# EasyEDA Pro project Esp32.epro

# Schematic BalanceMainBoard
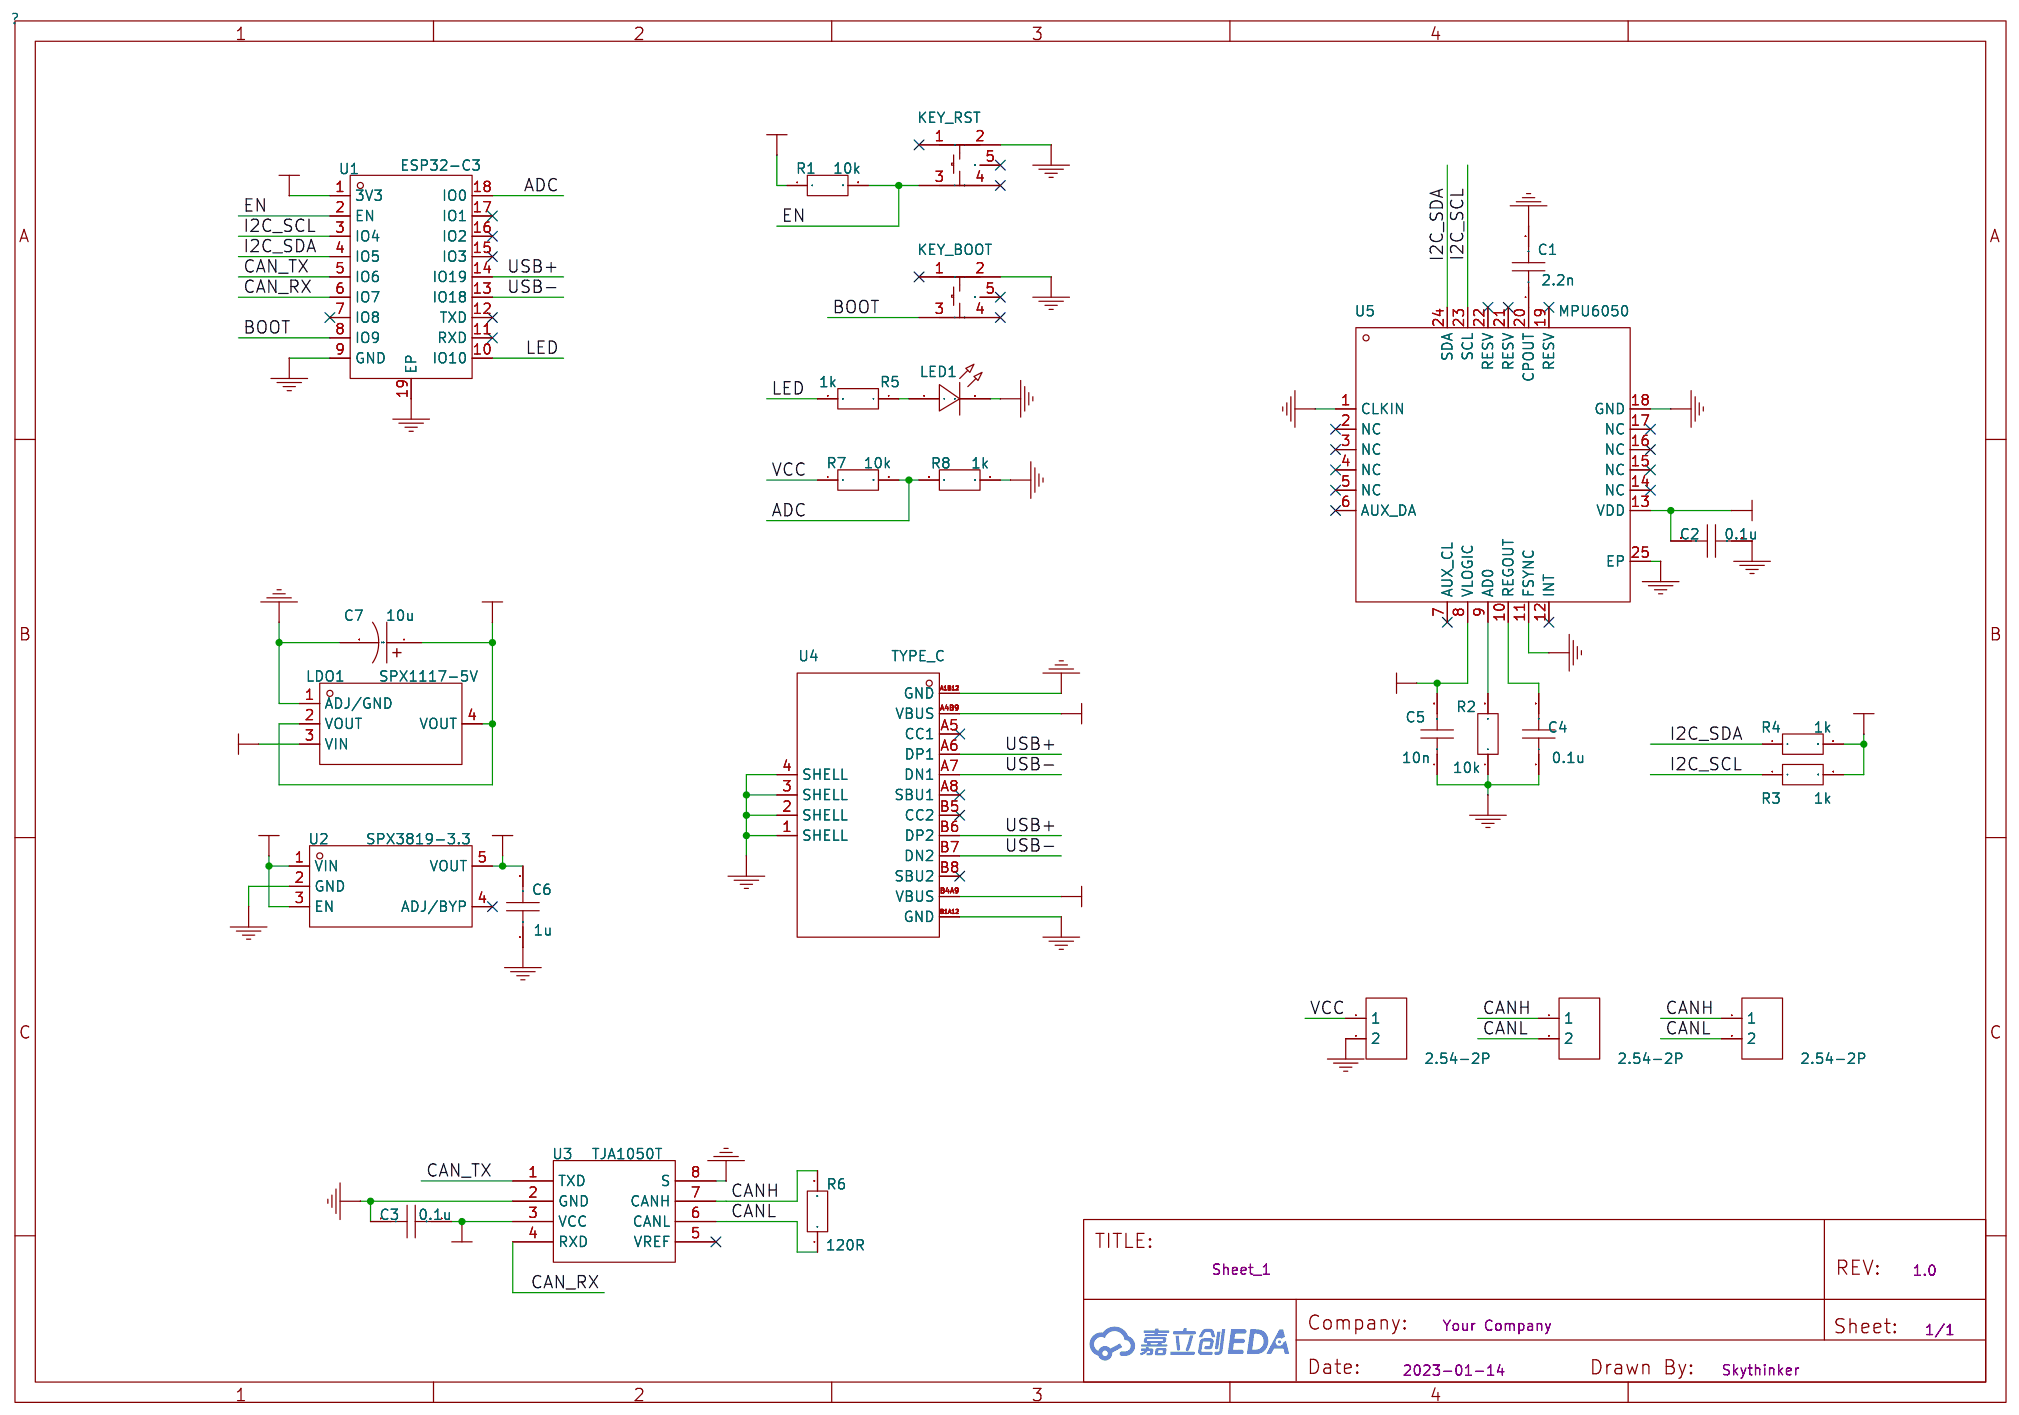
[diagram p0: schematic sheet]

## Parts
C1  2.2n
C2  0.1u
C3  0.1u
C4  0.1u
C5  10n
C6  1u
C7  10u
J1  2.54-2P  (no BOM)
J3  2.54-2P  (no BOM)
J4  2.54-2P  (no BOM)
KEY_BOOT  YTSA007A0152501B
KEY_RST  YTSA007A0152501B
LDO1  SPX1117-5V
LED1  LED-0603_R
R1  10k
R2  10k
R3  1k
R4  1k
R5  1k
R6  120R
R7  10k
R8  1k
U1  ESP32-C3
U2  SPX3819-3.3
U3  TJA1050T
U4  TYPE_C
U5  MPU6050

## Library data of the parts
C1 = 2.2n
C2-C4 = 0.1u
C5 = 10n
C6 = 1u
C7 = 10u
J1 J3 J4 = 2.54-2P: Supplier Part: C124375; Supplier: LCSC
KEY_BOOT KEY_RST = YTSA007A0152501B: Supplier: LCSC; Supplier Part: C967768; Manufacturer: DGBZ; JLCPCB Part Class: Extended Part
LDO1 = SPX1117M3-L/TR: Supplier: LCSC; Manufacturer: MaxLinear; Supplier Part: C67402; JLCPCB Part Class: Extended Part
LED1 = 19-217/R6C-AL1M2VY/3T: Manufacturer: EVERLIGHT(台湾亿光); Supplier Part: C72044; Supplier: LCSC
R1 R2 R7 = 10k
R3-R5 R8 = 1k
R6 = 120R
U1 = ESP32-C3-WROOM-02-N4: Supplier: LCSC; Supplier Part: C9900000362; JLCPCB Part Class: Extended Part; link: https://img.jlc.com//pdf/applyPasteComponent/2021-09-22/691768A/573e676df3ac4789afe05c8f8f79425b/esp32-c3-wroom-02_datasheet_cn.pdf; Manufacturer: null
U2 = SPX3819M5-3.3: Supplier: LCSC; Supplier Part: C9900018941; Manufacturer: null; JLCPCB Part Class: Extended Part
U3 = TJA1050T/CM,118: Supplier: LCSC; Manufacturer: NXP(恩智浦); Supplier Part: C6952; JLCPCB Part Class: Basic Part
U4 = TYPE_16/20: Supplier: LCSC; Supplier Part: C9900017551; Manufacturer: null; JLCPCB Part Class: Extended Part
U5 = MPU6050-YJLTY: Supplier: LCSC; Supplier Part: C2912107; Manufacturer: null; JLCPCB Part Class: Extended Part

## Nets
3V3: C2.1 C5.2 C6.2 R1.1 R3.2 R4.2 U1.1(3V3) U2.5(VOUT) U5.8(VLOGIC) U5.13(VDD)
5V0: C3.2 C7.1 LDO1.2(VOUT) LDO1.4(VOUT) U2.1(VIN) U2.3(EN) U3.3(VCC) U4.A4B9(VBUS) U4.B4A9(VBUS)
GND: C1.2 C2.2 C3.1 C4.1 C5.1 C6.1 C7.2 J1.2 KEY_BOOT.2 KEY_RST.2 LDO1.1(ADJ/GND) LED1.2 R2.1 R8.1 U1.9(GND) U1.19(EP) U2.2(GND) U3.2(GND) U3.8(S) U4.1(SHELL) U4.2(SHELL) U4.3(SHELL) U4.4(SHELL) U4.A1B12(GND) U4.B1A12(GND) U5.1(CLKIN) U5.11(FSYNC) U5.18(GND) U5.25(EP)
VCC: J1.1 LDO1.3(VIN) R7.1
ADC: R7.2 R8.2 U1.18(IO0)
BOOT: KEY_BOOT.3 U1.8(IO9)
CAN_RX: U1.6(IO7) U3.4(RXD)
CAN_TX: U1.5(IO6) U3.1(TXD)
CANH: J3.1 J4.1 R6.2 U3.7(CANH)
CANL: J3.2 J4.2 R6.1 U3.6(CANL)
EN: KEY_RST.3 R1.2 U1.2(EN)
I2C_SCL: R3.1 U1.3(IO4) U5.23(SCL)
I2C_SDA: R4.1 U1.4(IO5) U5.24(SDA)
LED: R5.2 U1.10(IO10)
USB+: U1.14(IO19) U4.A6(DP1) U4.B6(DP2)
USB-: U1.13(IO18) U4.A7(DN1) U4.B7(DN2)
Net-(C1-1): C1.1 U5.20(CPOUT)
Net-(C4-2): C4.2 U5.10(REGOUT)
Net-(LED1-1): LED1.1 R5.1
Net-(R2-2): R2.2 U5.9(AD0)

Not connected (* = marked no-connect by the designer): KEY_BOOT 1* 4* 5*; KEY_RST 1* 4* 5*; U1 7(IO8)* 11(RXD)* 12(TXD)* 15(IO3)* 16(IO2)* 17(IO1)*; U2 4(ADJ/BYP)*; U3 5(VREF)*; U4 A5(CC1)* A8(SBU1)* B5(CC2)* B8(SBU2)*; U5 2(NC)* 3(NC)* 4(NC)* 5(NC)* 6(AUX_DA)* 7(AUX_CL)* 12(INT)* 14(NC)* 15(NC)* 16(NC)* 17(NC)* 19(RESV)* 21(RESV)* 22(RESV)*

# Schematic Schematic1
Create Date: 2023-05-22; Page Name: P1; Project Name: esp32; Schematic Name: Schematic1; Update Date: 2023-08-26; Company: 嘉立创EDA; Page Size: A4; Version: V1.0
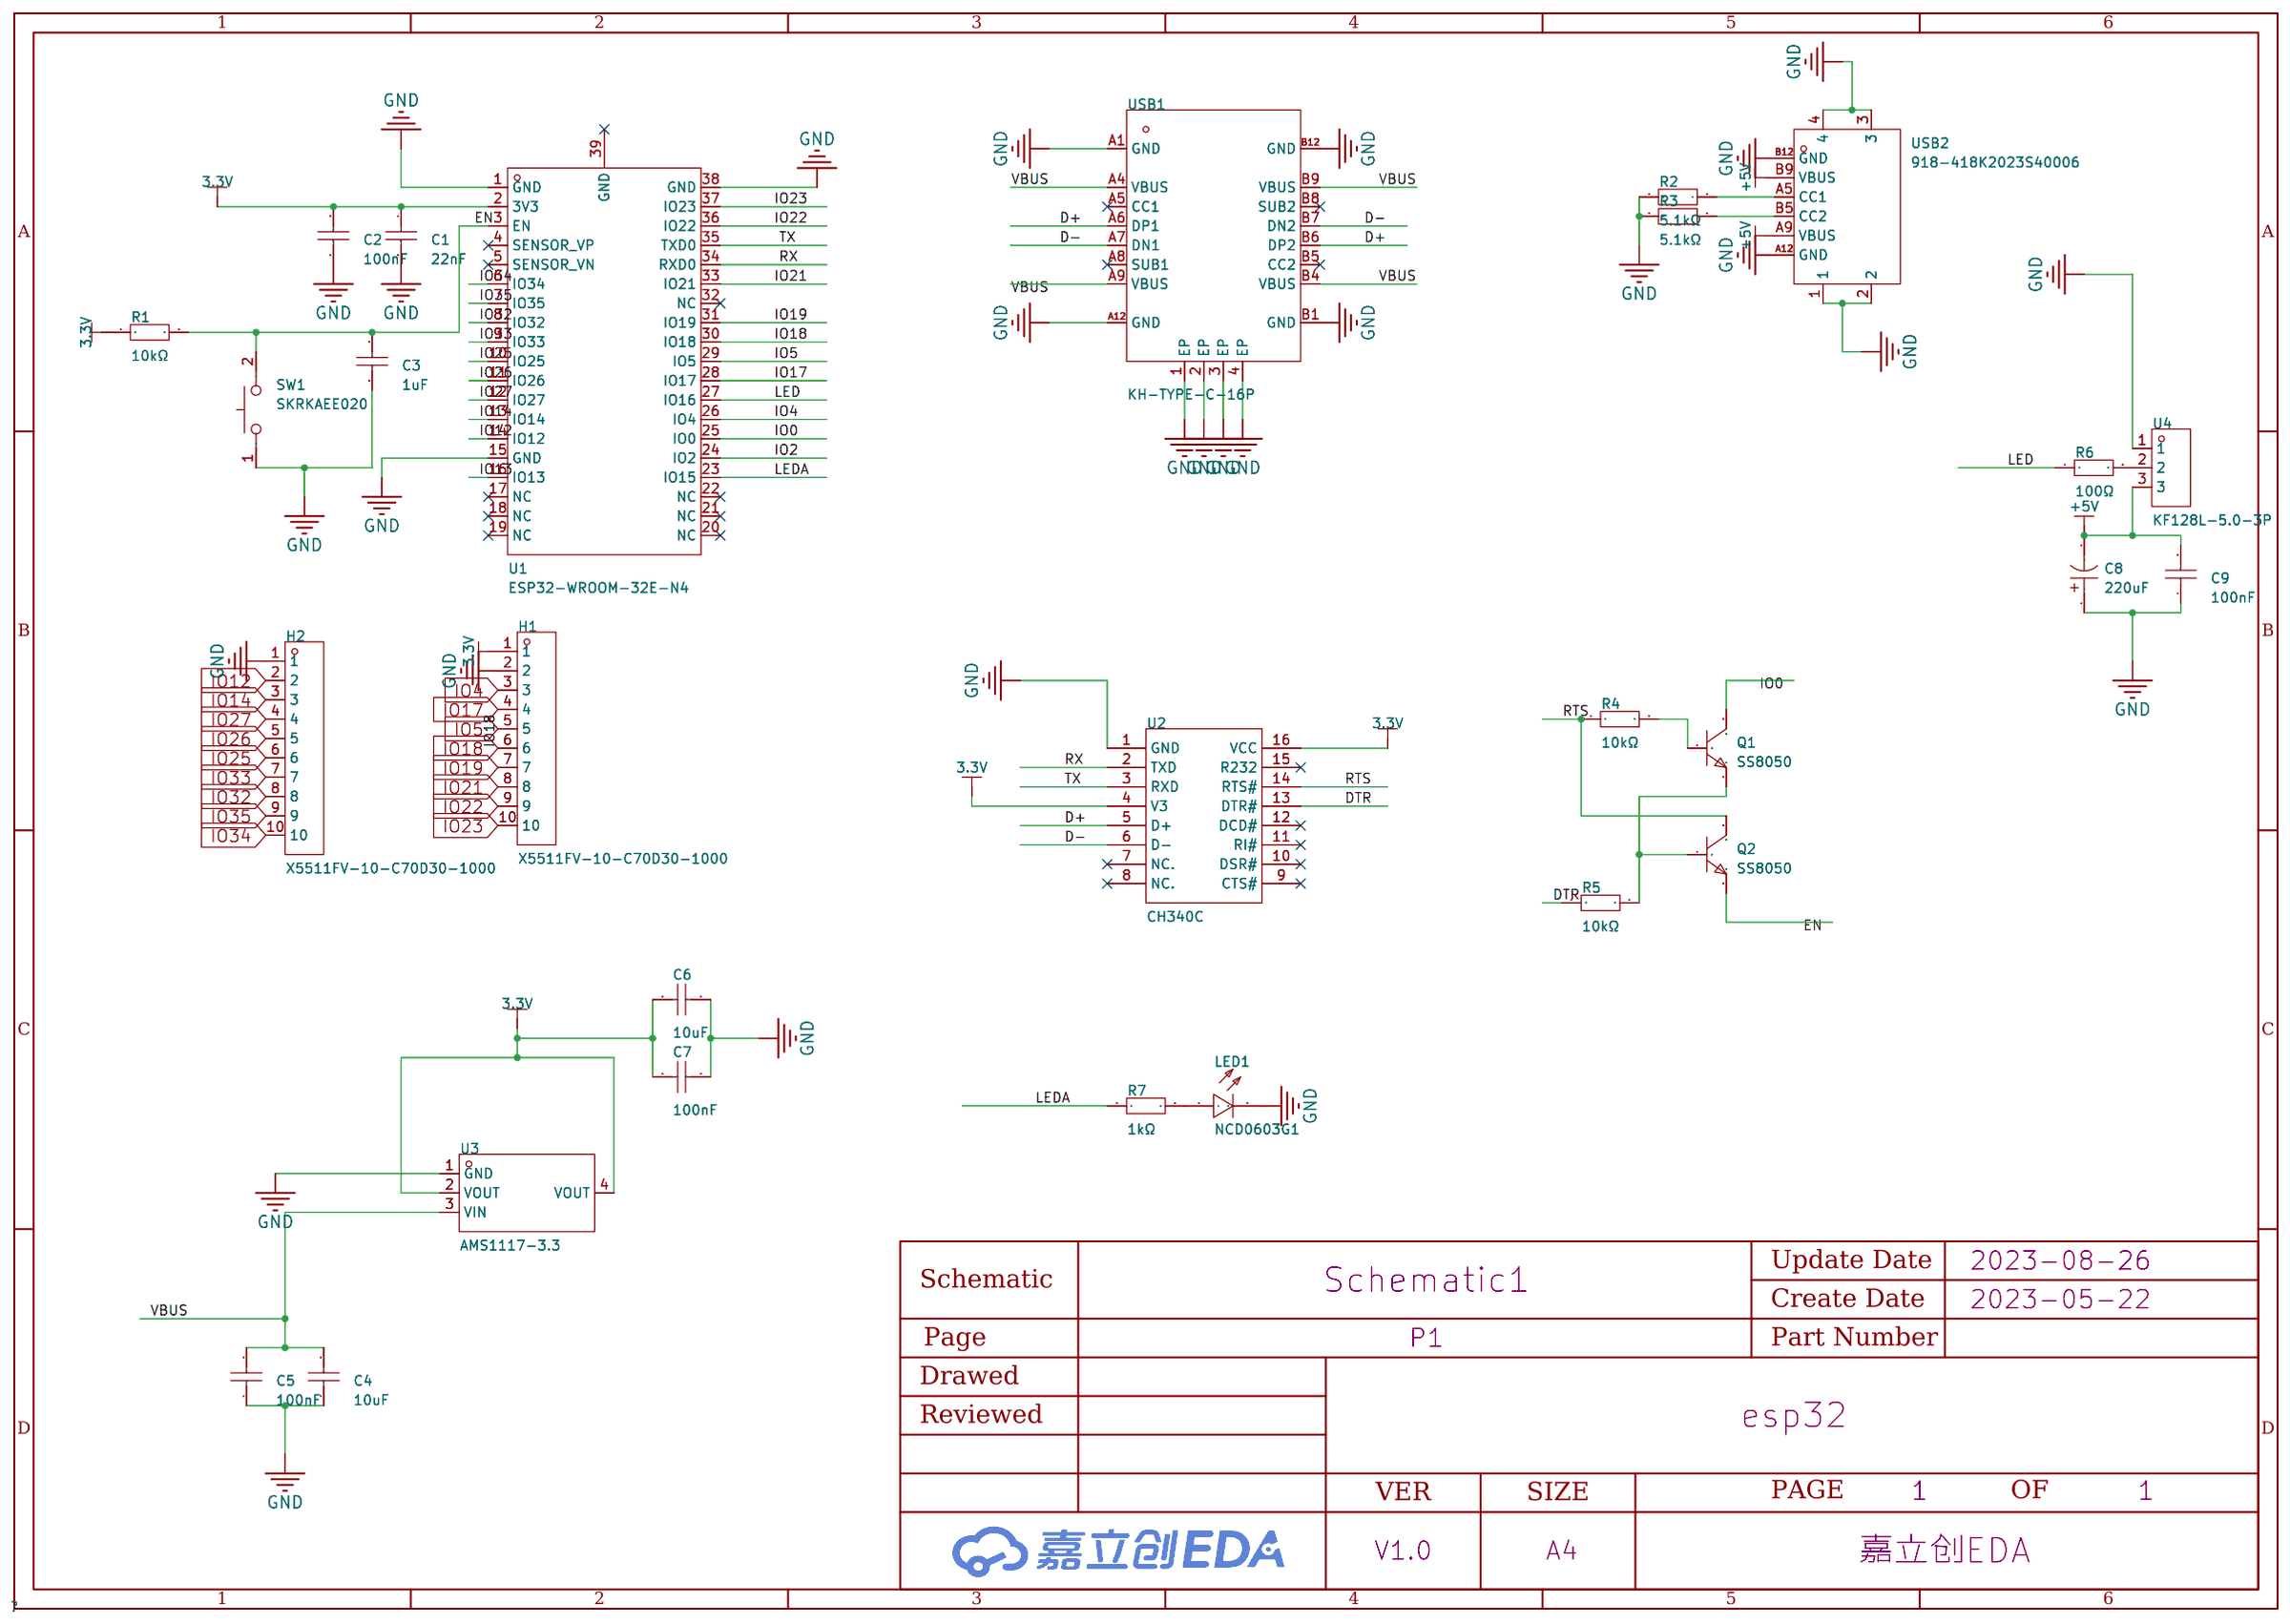
[diagram p1: schematic sheet]

## Parts
C1  22nF  [C0603]
C2  100nF  [C0603]
C3  1uF  [C0603]
C4  10uF  [C1206]
C5  100nF  [C0603]
C6  10uF  [C1206]
C7  100nF  [C0603]
C8  220uF  [CAP-SMD_BD8.0-L8.3-W8.3-LS9.3-FD]
C9  100nF  [C0603]
H1  X5511FV-10-C70D30-1000  [HDR-TH_10P-P2.54-V-F]
H2  X5511FV-10-C70D30-1000  [HDR-TH_10P-P2.54-V-F]
LED1  NCD0603G1  [LED0603-RD]
Q1  SS8050  [SOT-23-3_L2.9-W1.3-P1.90-LS2.4-BR]
Q2  SS8050  [SOT-23-3_L2.9-W1.3-P1.90-LS2.4-BR]
R1  10kΩ  [R0603]
R2  5.1kΩ  [R0603]
R3  5.1kΩ  [R0603]
R4  10kΩ  [R0603]
R5  10kΩ  [R0603]
R6  100Ω  [R0603]
R7  1kΩ  [R0603]
SW1  SKRKAEE020  [SW-SMD_L3.9-W3.0-P4.45]
U1  ESP32-WROOM-32E-N4  [WIFI-SMD_ESP32-WROOM-32E]
U2  CH340C  [SOP-16_L10.0-W3.9-P1.27-LS6.0-BL]
U3  AMS1117-3.3  [SOT-223-3_L6.5-W3.4-P2.30-LS7.0-BR]
U4  KF128L-5.0-3P  [CONN-TH_3P-P5.00_KF128L-5.0-3P]
USB1  KH-TYPE-C-16P  [USB-C-SMD_KH-TYPE-C-16P]
USB2  918-418K2023S40006  [USB-C-SMD_918-418K2023S40006]

## Library data of the parts
C1 = CL10B223KB8NNNC: 容值:22nF;精度:±10%;额定电压:50V;材质(温度系数):X7R;; LCSC Part Name: 22nF ±10% 50V; Supplier Part: C21122; Manufacturer: SAMSUNG(三星); Supplier Footprint: 0603; JLCPCB Part Class: Basic Part; Datasheet: https://atta.szlcsc.com/upload/public/pdf/source/20160103/1457707705232.pdf; Supplier: LCSC; Tolerance: ±10%; Voltage Rated: 50V; Temperature Coefficient: X7R
C2 C5 C7 C9 = 0603B104K500NT: 容值:100nF;精度:±10%;额定电压:50V;材质(温度系数):X7R;; LCSC Part Name: 100nF ±10% 50V; Supplier Part: C30926; Manufacturer: FH(风华); Supplier Footprint: 0603; JLCPCB Part Class: Extended Part; Datasheet: https://atta.szlcsc.com/upload/public/pdf/source/20170923/C30926_1506149436298988724.pdf; Supplier: LCSC; Tolerance: ±10%; Voltage Rated: 50V; Temperature Coefficient: X7R
C3 = CL10A105KB8NNNC: 容值:1uF;精度:±10%;额定电压:50V;材质(温度系数):X5R;; LCSC Part Name: 1uF ±10% 50V; Supplier Part: C15849; Manufacturer: SAMSUNG(三星); Supplier Footprint: 0603; JLCPCB Part Class: Basic Part; Datasheet: https://atta.szlcsc.com/upload/public/pdf/source/20160103/1457707679084.pdf; Supplier: LCSC; Tolerance: ±10%; Voltage Rated: 50V; Temperature Coefficient: X5R
C4 C6 = CL31A106KBHNNNE: 容值:10uF;精度:±10%;额定电压:50V;材质(温度系数):X5R;; LCSC Part Name: 10uF ±10% 50V; Supplier Part: C13585; Manufacturer: SAMSUNG(三星); Supplier Footprint: 1206; JLCPCB Part Class: Basic Part; Datasheet: https://atta.szlcsc.com/upload/public/pdf/source/20160103/1457707668742.pdf; Supplier: LCSC; Tolerance: ±10%; Voltage Rated: 50V; Temperature Coefficient: X5R
C8 = RVT220UF35V67RV0024: 容值:220uF;额定电压:35V;纹波电流:-;等效串联电阻:-;; LCSC Part Name: 220uF 35V; Supplier Part: C2836441; Manufacturer: KNSCHA(科尼盛); Supplier Footprint: SMD,D8xL10.2mm; JLCPCB Part Class: Extended Part; Datasheet: https://atta.szlcsc.com/upload/public/pdf/source/20210528/C2836441_17B1F737CDEB8BC64E6C288AF923F1CC.pdf; Supplier: LCSC; Rated Voltage: 35V; Lifetime @ Temp: 2000hrs@105℃
H1 H2 = X5511FV-10-C70D30-1000: 排数:单排;总孔位数:10;间距:2.54mm;插孔结构:1x10P;行距:-;安装类型:直插;圆孔/方孔:圆孔;额定电流:3A;额定电压:-;插孔方向:顶部;塑高:7mm;触头材质:黄铜;触头镀层:金;工作温度范围:-40℃~+105℃;焊接温度(最大值):260℃;; LCSC Part Name: 2.54mm 1x10P; Supplier Part: C2684744; Manufacturer: XKB Connectivity(中国星坤); Supplier Footprint: 直插,P=2.54mm; JLCPCB Part Class: Extended Part; Datasheet: https://atta.szlcsc.com/upload/public/pdf/source/20210118/C2684739_C189B04B0AEE96BAD6B95F9E817AD865.pdf; Supplier: LCSC; Number of Rows: 单排; Number of Holes: 10; Pitch: 2.54mm; Holes Structure: 1x10P; Mounting Type: 直插; Circular Hole / Square Hole: 圆孔; Current Rating (Max): 3A; Holes Direction: 顶部; Insulation Height: 7mm; Contact Material: 黄铜; Contact Plating: 金; Operating Temperature Range: -40℃~+105℃; Welding Temperature (Max): 260℃
LED1 = NCD0603G1: 发光颜色:翠绿;; LCSC Part Name: 翠绿; Supplier Part: C84267; Manufacturer: 国星光电; Supplier Footprint: 0603; JLCPCB Part Class: Extended Part; Datasheet: https://atta.szlcsc.com/upload/public/pdf/source/20200820/C84267_04BA7703640BAC111D09F5EFB971FBF3.pdf; Supplier: LCSC; Emitted Color: 翠绿
Q1 Q2 = SS8050_C2150: 晶体管类型:NPN;集射极击穿电压(Vceo):25V;集电极电流(Ic):1.5A;功率(Pd):300mW;直流电流增益(hFE@Ic,Vce):200@100mA,1V;; LCSC Part Name: NPN 25V 1.5A Y1 200-350; Supplier Part: C2150; Manufacturer: CJ(江苏长电/长晶); Supplier Footprint: SOT-23; JLCPCB Part Class: Basic Part; Datasheet: https://atta.szlcsc.com/upload/public/pdf/source/20230322/AEE86F4B043774EFF80CAEA14A37D9E9.pdf; Supplier: LCSC; Transistor Type: NPN; Collector-Emitter Breakdown Voltage (Vceo): 25V; Collector Current (Ic): 1.5A; Power Dissipation (Pd): 300mW; Collector Cut-Off Current (Icbo): 100nA; Collector-Emitter Saturation Voltage (VCE(sat)@Ic,Ib): 500mV@800mA,80mA; DC Current Gain (hFE@Ic,Vce): 200@100mA,1V; Transition Frequency (fT): 100MHz; Operating Temperature: +150℃@(Tj)
R1 R4 R5 = 0603WAF1002T5E: 电阻类型:厚膜电阻;阻值:10kΩ;精度:±1%;功率:100mW;; LCSC Part Name: 厚膜电阻 10kΩ ±1% 100mW; Supplier Part: C25804; Manufacturer: UNI-ROYAL(厚声); Supplier Footprint: 0603; JLCPCB Part Class: Basic Part; Datasheet: https://atta.szlcsc.com/upload/public/pdf/source/20200306/C422600_1E6D84923E4A46A82E41ADD87F860B5C.pdf; Supplier: LCSC; Type: 厚膜电阻; Tolerance: ±1%; Power(Watts): 100mW; Temperature Coefficient: ±100ppm/℃; Overload Voltage (Max): 75V; Operating Temperature Range: -55℃~+155℃
R2 R3 = 0603WAF5101T5E: 电阻类型:厚膜电阻;阻值:5.1kΩ;精度:±1%;功率:100mW;; LCSC Part Name: 5.1kΩ ±1% 100mW; Supplier Part: C23186; Manufacturer: UNI-ROYAL(厚声); Supplier Footprint: 0603; JLCPCB Part Class: Basic Part; Datasheet: https://atta.szlcsc.com/upload/public/pdf/source/20200306/C422600_1E6D84923E4A46A82E41ADD87F860B5C.pdf; Supplier: LCSC; Type: 厚膜电阻; Tolerance: ±1%; Power(Watts): 100mW; Temperature Coefficient: ±100ppm/℃; Overload Voltage (Max): 75V; Operating Temperature Range: -55℃~+155℃
R6 = 0603WAF1000T5E: 电阻类型:厚膜电阻;阻值:100Ω;精度:±1%;功率:100mW;; LCSC Part Name: 100Ω ±1% 100mW; Supplier Part: C22775; Manufacturer: UNI-ROYAL(厚声); Supplier Footprint: 0603; JLCPCB Part Class: Basic Part; Datasheet: https://atta.szlcsc.com/upload/public/pdf/source/20200306/C422600_1E6D84923E4A46A82E41ADD87F860B5C.pdf; Supplier: LCSC; Type: 厚膜电阻; Tolerance: ±1%; Power(Watts): 100mW; Temperature Coefficient: ±200ppm/℃; Overload Voltage (Max): 75V; Operating Temperature Range: -55℃~+155℃
R7 = 0603WAF1001T5E: 电阻类型:厚膜电阻;阻值:1kΩ;精度:±1%;功率:100mW;; LCSC Part Name: 1kΩ ±1% 100mW; Supplier Part: C21190; Manufacturer: UNI-ROYAL(厚声); Supplier Footprint: 0603; JLCPCB Part Class: Basic Part; Datasheet: https://atta.szlcsc.com/upload/public/pdf/source/20200306/C422600_1E6D84923E4A46A82E41ADD87F860B5C.pdf; Supplier: LCSC; Type: 厚膜电阻; Tolerance: ±1%; Power(Watts): 100mW; Temperature Coefficient: ±100ppm/℃; Overload Voltage (Max): 75V; Operating Temperature Range: -55℃~+155℃
SW1 = SKRKAEE020: 触点电流:50mA;额定电压(DC):12V;电路结构:单刀单掷;安装方式:立贴;带灯:-;机械寿命:-;; LCSC Part Name: 3.9*2.9*2mm 立贴 轻触开关; Supplier Part: C115357; Manufacturer: ALPSALPINE(阿尔卑斯阿尔派); Supplier Footprint: SMD; JLCPCB Part Class: Extended Part; Datasheet: https://atta.szlcsc.com/upload/public/pdf/source/20170620/1497944814772.pdf; Supplier: LCSC; Contact Current: 50mA; Voltage Rating (DC): 12V; Circuit: 单刀单掷; Mounting Style: 立贴; Actuator Style: 圆形按钮; Switch Length: 3.9mm; Switch Width: 2.9mm; Switch Height: 2mm
U1 = ESP32-WROOM-32E-N4_C701341: ESP32-WROOM-32E 集成 ESP32-D0WD-V3 芯片，具有?高的稳定性和安全性能。; LCSC Part Name: 通用型Wi-Fi+BT+BLE的MCU模组 PCB板载天线模组; Supplier Part: C701341; Manufacturer: ESPRESSIF(乐鑫); Supplier Footprint: SMD,18x25.5mm; JLCPCB Part Class: Extended Part; Datasheet: https://atta.szlcsc.com/upload/public/pdf/source/20220601/0020821B65DE5740BBACA5FACC5CF3B6.pdf; Supplier: LCSC
U2 = CH340C: 应用功能:Transceiver;接口协议:USB 2.0;数据速率:2Mbps;供电电压:3.3V；5V;; Supplier Part: C84681; Manufacturer: WCH(南京沁恒); Supplier Footprint: SOP-16; JLCPCB Part Class: Extended Part; Datasheet: https://atta.szlcsc.com/upload/public/pdf/source/20200819/C84681_ADBED554CE321879DBD6B1D06488689C.pdf; Supplier: LCSC; Applications Function: Transceiver; Protocol: USB 2.0; Data Rate: 2Mbps; Supply Voltage: 3.3V；5V
U3 = AMS1117-3.3_C6186: 输出类型:固定;输出极性:正;最大输入电压:-;输出电压:3.3V;输出电流:1A;电源纹波抑制比(PSRR):72dB@(120Hz);; LCSC Part Name: 输出3.3V 1A; Supplier Part: C6186; Manufacturer: AMS; Supplier Footprint: SOT-223; JLCPCB Part Class: Basic Part; Datasheet: https://atta.szlcsc.com/upload/public/pdf/source/20180727/C6186_7A095716F0823C02F1997A905E26C086.pdf; Supplier: LCSC; Output Type: 固定; Output Polarity: 正; Number of Outputs: 1; Output Voltage: 3.3V; Dropout Voltage: 1.3V@(800mA); Output Current: 1A; Power Supply Rejection Ratio (PSRR): 72dB@(120Hz)
U4 = KF128L-5.0-3P: LCSC Part Name: 间距P=5.0mm 3Pin位 直插 直针 可拼接 铜 环保 可拼接 铜 环保; Supplier Part: C474939; Manufacturer: KEFA(科发); Supplier Footprint: P=5mm; JLCPCB Part Class: Extended Part; Datasheet: https://atta.szlcsc.com/upload/public/pdf/source/20230317/752C0AC053DC32F5BE41F95D5E9BCBBC.pdf; Supplier: LCSC
USB1 = KH-TYPE-C-16P: 连接器类型:Type-C;标准:-;公母:母座;触点数量:16;端口数量:1;安装方式:卧贴;额定电流 - 电源:3A;工作温度范围:-40℃~+85℃;; LCSC Part Name: Type-C 母座 卧贴; Supplier Part: C709357; Manufacturer: kinghelm(金航标); Supplier Footprint: SMD; JLCPCB Part Class: Extended Part; Datasheet: https://atta.szlcsc.com/upload/public/pdf/source/20200911/C709357_AA8DCEB38BB20E3035A7ED7AE7667837.pdf; Supplier: LCSC; Connector Type: Type-C; Gender: 母座; Number of Contacts: 16; Number of Ports: 1; Mounting Style: 卧贴; Current Rating - Power (Max): 3A; Operating Temperature Range: -40℃~+85℃
USB2 = 918-418K2023S40006: 连接器类型:Type-C;标准:USB 3.1;公母:母座;触点数量:6;端口数量:1;安装方式:卧贴;额定电流 - 电源:-;工作温度范围:-40℃~+85℃;; LCSC Part Name: Type-C 母座 卧贴 无弹单排LCP黑胶; Supplier Part: C399925; Manufacturer: 精拓金; Supplier Footprint: SMD; JLCPCB Part Class: Extended Part; Datasheet: https://atta.szlcsc.com/upload/public/pdf/source/20190620/C399925_D8B78B8101E8027AE7B71A8976357F30.pdf; Supplier: LCSC; Connector Type: Type-C; Standard: USB 3.1; Gender: 母座; Number of Contacts: 6; Number of Ports: 1; Mounting Style: 卧贴; Operating Temperature Range: -40℃~+85℃

## Nets
3.3V: C1.1 C2.2 C6.2 C7.2 H1.1 R1.1 U1.2(3V3) U2.4(V3) U2.16(VCC) U3.2(VOUT) U3.4(VOUT)
+5V: C8.2 C9.2 U4.3 USB2.A9(VBUS) USB2.B9(VBUS)
GND: C1.2 C2.1 C3.1 C4.1 C5.1 C6.1 C7.1 C8.1 C9.1 H1.2 H2.1 LED1.1(K) R2.2 R3.2 SW1.1 U1.1(GND) U1.15(GND) U1.38(GND) U2.1(GND) U3.1(GND) U4.1 USB1.1(EP) USB1.2(EP) USB1.3(EP) USB1.4(EP) USB1.A1(GND) USB1.A12(GND) USB1.B1(GND) USB1.B12(GND) USB2.1 USB2.2 USB2.3 USB2.4 USB2.A12(GND) USB2.B12(GND)
VBUS: C4.2 C5.2 U3.3(VIN) USB1.A4(VBUS) USB1.A9(VBUS) USB1.B4(VBUS) USB1.B9(VBUS)
D+: U2.5(D+) USB1.A6(DP1) USB1.B6(DP2)
D-: U2.6(D-) USB1.A7(DN1) USB1.B7(DN2)
DTR: R5.1 U2.13(DTR#)
EN: C3.2 Q2.2(E) R1.2 SW1.2 U1.3(EN)
IO0: Q1.3(C) U1.25(IO0)
IO2: U1.24(IO2)
IO4: H1.3 U1.26(IO4)
IO5: H1.5 U1.29(IO5)
IO12: H2.2 U1.14(IO12)
IO13: U1.16(IO13)
IO14: H2.3 U1.13(IO14)
IO17: H1.4 U1.28(IO17)
IO18: H1.6 U1.30(IO18)
IO19: H1.7 U1.31(IO19)
IO21: H1.8 U1.33(IO21)
IO22: H1.9 U1.36(IO22)
IO23: H1.10 U1.37(IO23)
IO25: H2.6 U1.10(IO25)
IO26: H2.5 U1.11(IO26)
IO27: H2.4 U1.12(IO27)
IO32: H2.8 U1.8(IO32)
IO33: H2.7 U1.9(IO33)
IO34: H2.10 U1.6(IO34)
IO35: H2.9 U1.7(IO35)
LED: R6.1 U1.27(IO16)
LEDA: R7.1 U1.23(IO15)
RTS: Q2.3(C) R4.1 U2.14(RTS#)
RX: U1.34(RXD0) U2.2(TXD)
TX: U1.35(TXD0) U2.3(RXD)
$1N2213: R2.1 USB2.A5(CC1)
$1N2350: R3.1 USB2.B5(CC2)
$1N2939: Q1.1(B) R4.2
$1N4330: R6.2 U4.2
$1N4919: LED1.2(A) R7.2
$1N5572: Q1.2(E) Q2.1(B) R5.2

Not connected (* = marked no-connect by the designer): U1 4(SENSOR_VP)* 5(SENSOR_VN)* 17(NC)* 18(NC)* 19(NC)* 20(NC)* 21(NC)* 22(NC)* 32(NC)* 39(GND)*; U2 7(NC.)* 8(NC.)* 9(CTS#)* 10(DSR#)* 11(RI#)* 12(DCD#)* 15(R232)*; USB1 A5(CC1)* A8(SUB1)* B5(CC2)* B8(SUB2)*

# Board PCB4
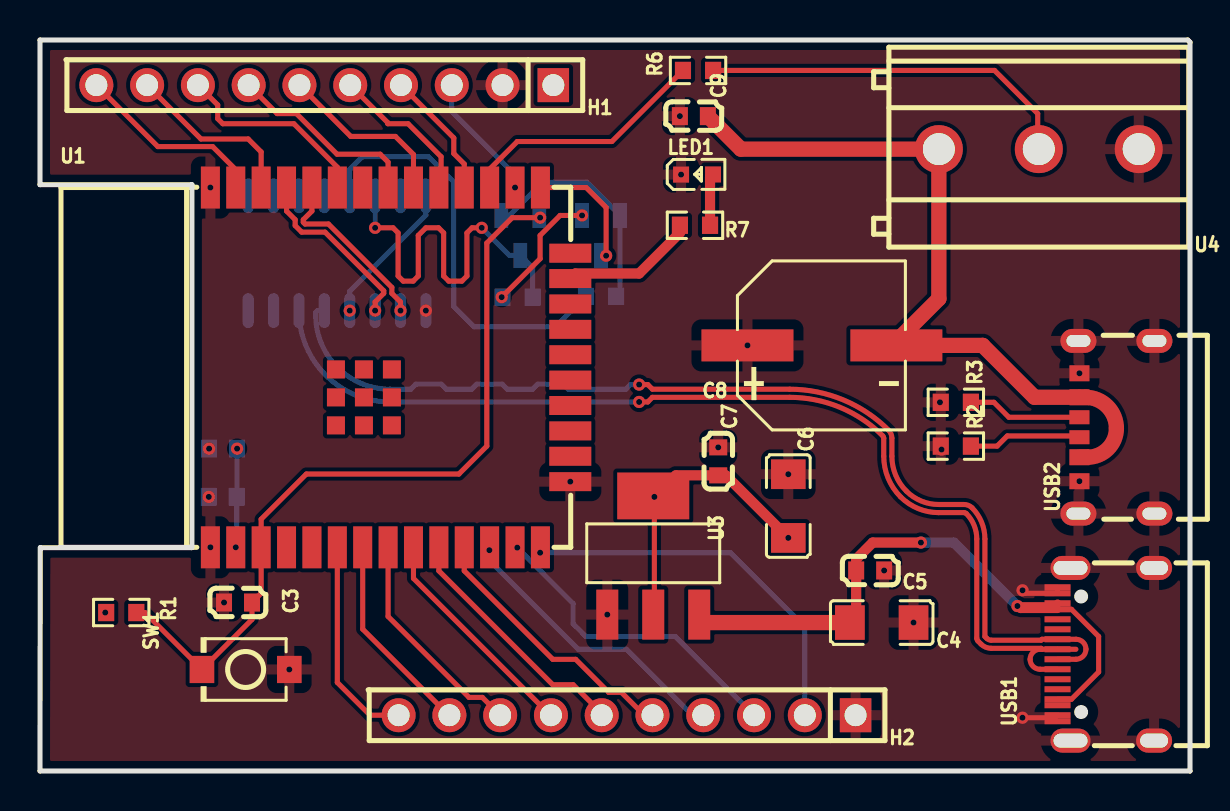
[diagram p2: board, top side]
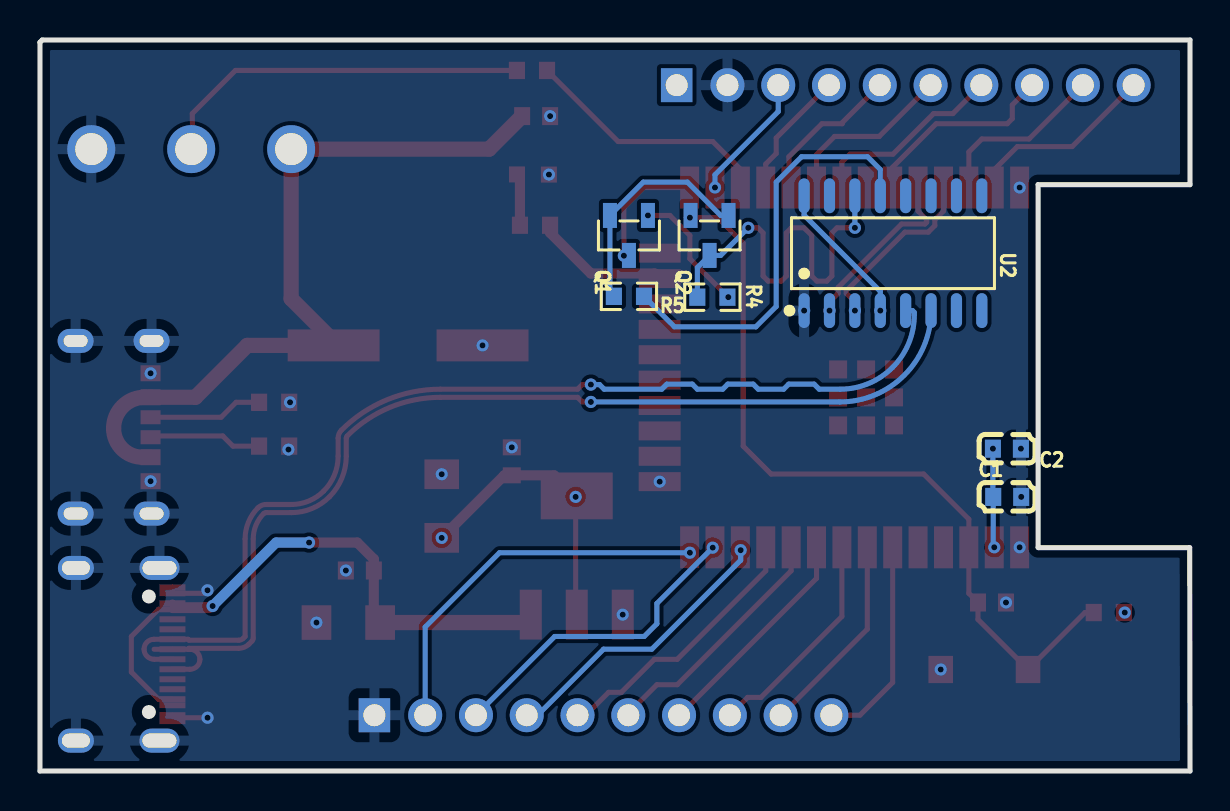
[diagram p3: board, bottom side, seen from below]

Outline 57.53 x 36.58 mm; copper layers: Top Layer, Inner1, Inner2, Bottom Layer. Coordinates in mm from the lower left corner of the outline.
Outline path: 0,0 57.53,0 57.53,36.46 57.42,36.58 0,36.58 0,29.34 7.6,29.34 7.6,11.19 7.58,11.18 0.02,11.18 0,0
Stack: Top Layer 0.035mm 外层铜厚1oz / Dielectric1 0.2104mm 7628 RC49% 8.6mil / Inner1 0.0152mm 内层铜厚 / Dielectric2 1.065mm 1.1mm H/HOZ 含铜 / Inner2 0.0152mm 内层铜厚 / Dielectric3 0.2104mm 7628 RC49% 8.6mil / Bottom Layer 0.035mm 外层铜厚1oz

## Design rules (mm)
net RX: DP2
net TX: DP2
net D-: DP1
net D+: DP1
net RTS: DP3
net DTR: DP3
template: JLCPCB Capability(Two Layers Board)
spacing copperThickness1oz (default): track to track 0.102, other pairs 0.152 to 0.3
spacing copperThickness2oz: track to track 0.203, other pairs 0.152 to 0.3
track width copperThickness1oz (default): min 0.127, default 0.254, max 2.54
track width copperThickness2oz: min 0.203, default 0.254, max 2.54
differential pair differentialPair (default): width min 0.127, default 0.254, max 2.54; gap min 0.152, default 0.152
via viaSize (default): diameter min 0.5, default 0.61, max 10; hole min 0.3, default 0.305, max 6.3

## Placement (name value [footprint] x y rotation side)
C1  22nF  [C0603]  9.14 13.72 180 bottom
C2  100nF  [C0603]  9.16 16.13 0 bottom
C3  1uF  [C0603]  9.91 8.43 0 top
C4  10uF  [C1206]  42.11 7.43 180 top
C5  100nF  [C0603]  41.53 10.03 180 top
C6  10uF  [C1206]  37.43 13.26 270 top
C7  100nF  [C0603]  33.93 15.49 270 top
C8  220uF  [CAP-SMD_BD8.0-L8.3-W8.3-LS9.3-FD]  39.12 21.3 0 top
C9  100nF  [C0603]  32.71 32.77 0 top
H1  X5511FV-10-C70D30-1000  [HDR-TH_10P-P2.54-V-F]  14.25 34.32 180 top
H2  X5511FV-10-C70D30-1000  [HDR-TH_10P-P2.54-V-F]  29.37 2.79 180 top
LED1  NCD0603G1  [LED0603-RD]  32.87 29.84 0 top
Q1  SS8050  [SOT-23-3_L2.9-W1.3-P1.90-LS2.4-BR]  28.07 26.8 90 bottom
Q2  SS8050  [SOT-23-3_L2.9-W1.3-P1.90-LS2.4-BR]  24.03 26.8 90 bottom
R1  10kΩ  [R0603]  4.06 7.93 0 top
R2  5.1kΩ  [R0603]  45.82 16.26 180 top
R3  5.1kΩ  [R0603]  45.82 18.45 180 top
R4  10kΩ  [R0603]  23.89 23.71 180 bottom
R5  10kΩ  [R0603]  28.07 23.75 0 bottom
R6  100Ω  [R0603]  32.92 35.05 0 top
R7  1kΩ  [R0603]  32.77 27.31 0 top
SW1  SKRKAEE020  [SW-SMD_L3.9-W3.0-P4.45]  10.29 5.08 180 top
U1  ESP32-WROOM-32E-N4  [WIFI-SMD_ESP32-WROOM-32E]  17.53 20.19 0 top
U2  CH340C  [SOP-16_L10.0-W3.9-P1.27-LS6.0-BL]  14.86 25.91 180 bottom
U3  AMS1117-3.3  [SOT-223-3_L6.5-W3.4-P2.30-LS7.0-BR]  30.68 10.8 270 top
U4  KF128L-5.0-3P  [CONN-TH_3P-P5.00_KF128L-5.0-3P]  49.97 31.11 180 top
USB1  KH-TYPE-C-16P  [USB-C-SMD_KH-TYPE-C-16P]  53.32 5.84 90 top
USB2  918-418K2023S40006  [USB-C-SMD_918-418K2023S40006]  53.85 17.2 90 top

## Footprints (pads in the part's own frame, mm; a bottom-side part is the same pattern mirrored in y, then rotated)
C0603
  rect 0.8x0.9 smd: 1(-0.7,0) 2(0.7,0)
C1206
  rect 1.485x1.728 smd: 1(-1.593,0) 2(1.593,0)
CAP-SMD_BD8.0-L8.3-W8.3-LS9.3-FD
  rect 4.6x1.6 smd: 1(-3.724,0) 2(3.724,0)
CONN-TH_3P-P5.00_KF128L-5.0-3P
  round 2.4 hole 1.6: 1(-5,0) 2(0,0) 3(5,0)
HDR-TH_10P-P2.54-V-F
  rect 1.575x1.7 hole 1.1: 1(-11.43,0)
  round 1.7 hole 1.1: 2(-8.89,0) 3(-6.35,0) 4(-3.81,0) 5(-1.27,0) 6(1.27,0) 7(3.81,0) 8(6.35,0) 9(8.89,0) 10(11.43,0)
LED0603-RD
  rect 0.8x0.8 smd: 1(-0.799,-0.004) 2(0.799,0.004)
R0603
  rect 0.806x0.864 smd: 1(-0.753,0) 2(0.753,0)
SOP-16_L10.0-W3.9-P1.27-LS6.0-BL
  oval 0.56x1.745 smd: 1(-4.445,-2.873) 2(-3.175,-2.873) 3(-1.905,-2.873) 4(-0.635,-2.873) 5(0.635,-2.873) 6(1.905,-2.873) 7(3.175,-2.873) 8(4.445,-2.873) 9(4.445,2.873) 10(3.175,2.873) 11(1.905,2.873) 12(0.635,2.873) 13(-0.635,2.873) 14(-1.905,2.873) 15(-3.175,2.873) 16(-4.445,2.873)
SOT-23-3_L2.9-W1.3-P1.90-LS2.4-BR
  rect 1.25x0.7 smd: 1(1,-0.95) 2(1,0.95) 3(-1,0)
SOT-223-3_L6.5-W3.4-P2.30-LS7.0-BR
  rect 2.5x1.1 smd: 1(2.97,-2.3) 2(2.97,0) 3(2.97,2.3)
  rect 2.34x3.6 smd: 4(-2.97,0)
SW-SMD_L3.9-W3.0-P4.45
  rect 1.23x1.36 smd: 1(-2.185,0) 2(2.185,0)
USB-C-SMD_918-418K2023S40006
  oval 1.2x1.8 hole 0.6x1.2: 1(4.32,1.9) 2(4.32,-1.9) 3(-4.32,-1.9) 4(-4.32,1.9)
  rect 0.7x1 smd: A5(-0.5,1.85) B5(0.5,1.85)
  rect 0.8x1 smd: A9(1.5,1.85) A12(2.7,1.85) B9(-1.5,1.85) B12(-2.7,1.85)
USB-C-SMD_KH-TYPE-C-16P
  oval 1.2x2 hole 0.7x1.7: 1(-4.32,1.765) 2(4.32,1.765)
  oval 1.2x1.8 hole 0.7x1.4: 3(-4.32,-2.415) 4(4.32,-2.415)
  rect 0.3x1.3 smd: A1(-3.35,2.415) A4(-2.55,2.415) A5(-1.25,2.415) A6(-0.25,2.415) A7(0.25,2.415) A8(1.25,2.415) A9(2.55,2.415) A12(3.35,2.415) B1(3.05,2.415) B4(2.25,2.415) B5(1.75,2.415) B6(0.75,2.415) B7(-0.75,2.415) B8(-1.75,2.415) B9(-2.25,2.415) B12(-3.05,2.415)
WIFI-SMD_ESP32-WROOM-32E
  rect 0.95x2.1 smd: 1(-9.002,-9) 2(-7.732,-9) 3(-6.463,-9) 4(-5.192,-9) 5(-3.922,-9) 6(-2.652,-9) 7(-1.383,-9) 8(-0.113,-9) 9(1.157,-9) 10(2.428,-9) 11(3.697,-9) 12(4.968,-9) 13(6.237,-9) 14(7.508,-9) 25(7.508,9) 26(6.237,9) 27(4.968,9) 28(3.697,9) 29(2.428,9) 30(1.157,9) 31(-0.113,9) 32(-1.383,9) 33(-2.652,9) 34(-3.922,9) 35(-5.192,9) 36(-6.463,9) 37(-7.732,9) 38(-9.002,9)
  rect 2.1x0.95 smd: 15(9.002,-5.715) 16(9.002,-4.445) 17(9.002,-3.175) 18(9.002,-1.905) 19(9.002,-0.635) 20(9.002,0.635) 21(9.002,1.905) 22(9.002,3.175) 23(9.002,4.445) 24(9.002,5.715)
  rect 0.9x0.9 smd: 39(-2.721,-0.1) 39(-2.721,-1.5) 39(-2.721,-2.9) 39(-1.321,-0.1) 39(-1.321,-1.5) 39(-1.321,-2.9) 39(0.079,-0.1) 39(0.079,-1.5) 39(0.079,-2.9)

## Nets
As in the schematic.

Pads without a net: U1 4 5 17 18 19 20 21 22 32 39; U2 7 8 9 10 11 12 15; USB1 A5 A8 B5 B8

## Via types
v1: diameter 0.61, hole 0.305, Top Layer to Bottom Layer, 44 vias

## Routing (per net, layer and track width the routed paths; a pad name or vN(x,y) marks a point on that pad's centre or on a via; arc(x,y) is an arc through that point)
3.3V: length 26.5
  Top Layer w0.254: v1(30.73,13.72) 30.73,7.88 U3.2
  Top Layer w0.508: v1(37.43,11.66) 34.3,14.79 C7.2 31.81,14.79 v1(30.73,13.72)
  Bottom Layer w0.254: 9.84,11.3 C1.1 9.86,13.73 v1(9.86,16.13) ; U2.16 19.3,27.81 15.49,24 v1(15.49,23.04)
  vias: v1(3.26,7.93) v1(9.79,11.19)
+5V: length 38.3
  Top Layer w0.762: C9.2 35.06,31.11 U4.3 44.97,23.63 42.93,21.59 ; C8.2 47.16,21.3 49.75,18.7 USB2.A9 52.29,18.7 arc(53.39,18.24) 53.85,17.14 arc(53.43,16.12) 52.4,15.7 USB2.B9
GND: length 3.9
  Top Layer w0.254: USB1.A12 USB1.B1 49.3,8.89 v1(49.15,9.04) ; USB1.B12 50.78,2.67 v1(49.15,2.67)
  vias: v1(8.44,13.72) v1(8.52,29.19) v1(8.46,16.13) v1(8.52,11.19) v1(9.21,8.43) v1(12.47,5.08) v1(19.3,23.04) v1(26.53,14.48) v1(28.38,7.83) v1(32.01,32.77) v1(32.07,29.84) v1(33.93,16.19) v1(35.39,21.3) v1(37.43,14.85) v1(42.23,10.03) v1(43.7,7.43) v1(45.02,18.45) v1(45.1,16.08) v1(52,19.9) v1(52,14.5)
VBUS: length 31.9
  Top Layer w0.254: USB1.B9 51.6,3.59 52.96,4.95 52.96,6.73 51.6,8.09 USB1.B4 ; 33.38,7.43 U3.3
  Top Layer w0.381: USB1.B4 49.06,8.09 v1(48.9,8.25) 50.77,8.25 USB1.A9
  Top Layer w0.508: v1(44.07,11.43) 41.66,11.43 40.83,10.6 C5.2 40.83,7.74 C4.2
  Top Layer w0.762: C4.2 33.38,7.43
  Bottom Layer w0.508: v1(44.07,11.43) 45.72,11.43 v1(48.9,8.25)
D+: length 53.3
  Top Layer w0.254: USB1.A6 51.82,5.59 arc(52.18,5.74) 52.32,6.1 arc(52.18,6.45) 51.83,6.59 USB1.B6 50.13,6.59 50.08,6.55 47.59,6.55 arc(47.47,6.57) 47.36,6.64 47.27,6.73 47.27,11.61 arc(47.1,12.46) 46.62,13.17 arc(46.44,13.29) 46.23,13.33 44.95,13.33 arc(44.08,13.51) 43.34,14 arc(42.8,14.81) 42.62,15.75 42.62,16.66 arc(42.57,16.87) 42.45,17.05 arc(40.18,18.57) 37.5,19.1 30.64,19.1 30.4,19.33 v1(29.97,19.33)
  Bottom Layer w0.254: v1(29.97,19.33) 29.54,19.33 29.31,19.1 26.42,19.1 26.17,19.36 24.9,19.36 24.65,19.1 23.38,19.1 23.12,19.36 21.85,19.36 21.6,19.1 20.33,19.1 20.07,19.36 18.8,19.36 18.55,19.1 17.51,19.1 arc(14.88,20.19) 13.79,22.82 13.79,22.95 13.88,23.04 U2.5
D-: length 53.3
  Top Layer w0.254: 51.82,6.09 USB1.A7 50.13,6.09 ; v1(29.97,18.47) 30.4,18.47 30.64,18.7 37.5,18.7 arc(40.02,18.19) 42.16,16.76 arc(42.2,16.71) 42.21,16.66 42.21,15.75 arc(42.43,14.65) 43.05,13.72 arc(43.93,13.13) 44.95,12.93 46.23,12.93 arc(46.29,12.92) 46.34,12.88 arc(46.73,12.3) 46.86,11.61 46.86,6.65 arc(46.88,6.57) 46.92,6.5 47.08,6.35 arc(47.31,6.19) 47.59,6.14 50.08,6.14 50.13,6.09 ; USB1.B7 50.03,5.09 arc(49.68,5.24) 49.53,5.59 arc(49.68,5.94) 50.03,6.09 50.13,6.09
  Bottom Layer w0.254: v1(29.97,18.47) 17.52,18.47 arc(14.29,19.8) U2.6
DTR: length 21.2
  Bottom Layer w0.254: R5.1 25.79,22.22 21.72,22.22 20.7,23.24 20.7,29.46 19.43,30.73 16.13,30.73 15.49,30.1 U2.13
EN: length 39.4
  Top Layer w0.254: R1.2 5.25,7.93 SW1.2 10.61,7.58 C3.2 11.06,8.89 U1.3 11.06,12.6 13.32,14.86 20.96,14.86 22.35,16.26 22.35,26.42 23.62,27.69 v1(25.02,27.69)
IO0: length 6.1
  Top Layer w0.254: v1(28.32,25.78) 28.32,28.19 27.32,29.19 U1.25
IO4: length 6.4
  Bottom Layer w0.254: H1.3 20.6,33 23.76,29.83 v1(23.76,29.19)
IO5: length 7.6
  Top Layer w0.254: U1.29 20.07,29.31 20.07,30.73 18.42,32.39 17.4,32.39 17.4,32.44 H1.5
IO12: length 19.2
  Bottom Layer w0.254: v1(25.02,10.92) 34.54,10.92 38.26,7.21 H2.2
IO14: length 15.9
  Bottom Layer w0.254: H2.3 31.78,6.73 27.31,6.73 26.67,7.37 26.67,8.38 v1(23.88,11.18)
IO17: length 6.4
  Top Layer w0.254: H1.4 20.7,31.67 20.7,30.89 21.22,30.37 U1.28
IO18: length 8.8
  Top Layer w0.254: 12.98,34.32 15.55,31.75 17.78,31.75 18.68,30.85 U1.30
IO19: length 9.8
  Top Layer w0.254: H1.7 11.86,32.89 12.83,32.89 14.86,30.86 17.02,30.86 17.41,30.47 U1.31
IO21: length 10.1
  Top Layer w0.254: U1.33 14.87,30.21 12.7,32.39 9.14,32.39 8.89,32.64 8.89,33.33 H1.8
IO22: length 8.9
  Top Layer w0.254: U1.36 11.06,30.97 10.41,31.62 8.05,31.62 H1.9
IO23: length 9.6
  Top Layer w0.254: 2.82,34.32 5.89,31.24 8.64,31.24 9.79,30.08 U1.37
IO25: length 12.4
  Top Layer w0.254: H2.6 28.1,2.89 26.67,4.32 25.65,4.32 19.95,10.02 U1.10
IO26: length 13.6
  Top Layer w0.254: U1.11 21.22,10.02 25.65,5.59 26.8,5.59 28.45,3.94 29.08,3.94 30.23,2.79 H2.5
IO27: length 14.4
  Bottom Layer w0.254: v1(22.48,11.05) 22.48,10.54 26.92,6.1 29.34,6.1 32.64,2.79 H2.4
IO32: length 11.1
  Top Layer w0.254: H2.8 22.13,3.68 21.46,3.68 17.41,7.73 U1.8
IO33: length 11.3
  Top Layer w0.254: H2.7 25.53,2.79 18.68,9.64 U1.9
IO34: length 10.5
  Top Layer w0.254: H2.10 17.94,2.79 16.51,2.79 14.87,4.43 U1.6
IO35: length 10.2
  Top Layer w0.254: H2.9 20.45,2.79 16.14,7.1 U1.7
LED: length 12.6
  Top Layer w0.254: U1.27 22.49,30.11 23.88,31.5 28.61,31.5 32.17,35.05
LEDA: length 6.8
  Top Layer w0.508: R7.1 32.01,26.93 29.97,24.89 26.78,24.89 U1.23
RTS: length 21.2
  Top Layer w0.254: v1(22.1,27.18) 21.61,27.18 21.36,26.92 21.36,24.77 21.1,24.51 20.45,24.51 20.19,24.77 20.19,26.92 19.94,27.18 19.3,27.18 18.92,26.8 18.92,24.77 18.67,24.51 18.17,24.51 17.92,24.77 17.92,26.92 17.66,27.18 v1(16.76,27.18)
  Bottom Layer w0.254: v1(22.1,27.18) 23.48,25.8 Q2.3 24.65,25.19 R4.1 ; v1(16.76,27.18) U2.14
RX: length 9
  Top Layer w0.254: U1.34 13.6,28.02 13.17,27.58 13.17,27.46 13.26,27.37 14.43,27.37 17.6,24.19 17.6,23.9 18.03,23.47 v1(18.03,23.04)
TX: length 9
  Top Layer w0.254: v1(16.76,23.04) 16.76,23.47 17.2,23.9 17.2,24.03 14.26,26.96 13.09,26.96 12.77,27.29 12.77,27.58 12.33,28.02 U1.35
$1N2213: length 5.7
  Top Layer w0.254: 46.57,16.26 47.88,16.26 48.39,16.76 51.93,16.76 USB2.A5
$1N2350: length 5.7
  Top Layer w0.254: 46.57,18.45 47.72,18.45 48.47,17.7 USB2.B5
$1N2939: length 6.4
  Top Layer w0.254: v1(27.12,27.8) 26.02,27.8 25.02,26.8 25.02,25.63 v1(23.1,23.71)
$1N4330: length 18.9
  Top Layer w0.254: R6.2 47.75,35.05 49.91,32.89 49.91,31.17 U4.2
$1N4919: length 2.6
  Top Layer w0.508: R7.2 33.52,29.7 LED1.2
$1N5572: length 11.4
  Bottom Layer w0.254: R5.2 29.02,23.95 Q1.2 27.35,29.46 25.15,29.46 23.48,27.8 Q2.1

## Copper pours and planes (outline as drawn; the poured copper is in the pictures)
3.3V on Inner2: 1.35,35.59 56.39,35.59 56.39,1.27 1.35,1.27
GND on Top Layer: -3.68,40 65.02,40 65.02,-5.08 -3.68,-5.08
GND on Bottom Layer: -9.78,39.37 69.6,39.37 69.6,-5.84 -9.78,-5.84
GND on Inner1: -4.7,41.15 66.8,41.15 66.8,-2.03 -4.7,-2.03
